# EAGLE design OSO-MISC-21-005 SAML22 Feather (EAGLE 9.6.2)
COMPANY: ADAFRUIT INDUSTRIES; DRAWN: KTOWN; REV: B
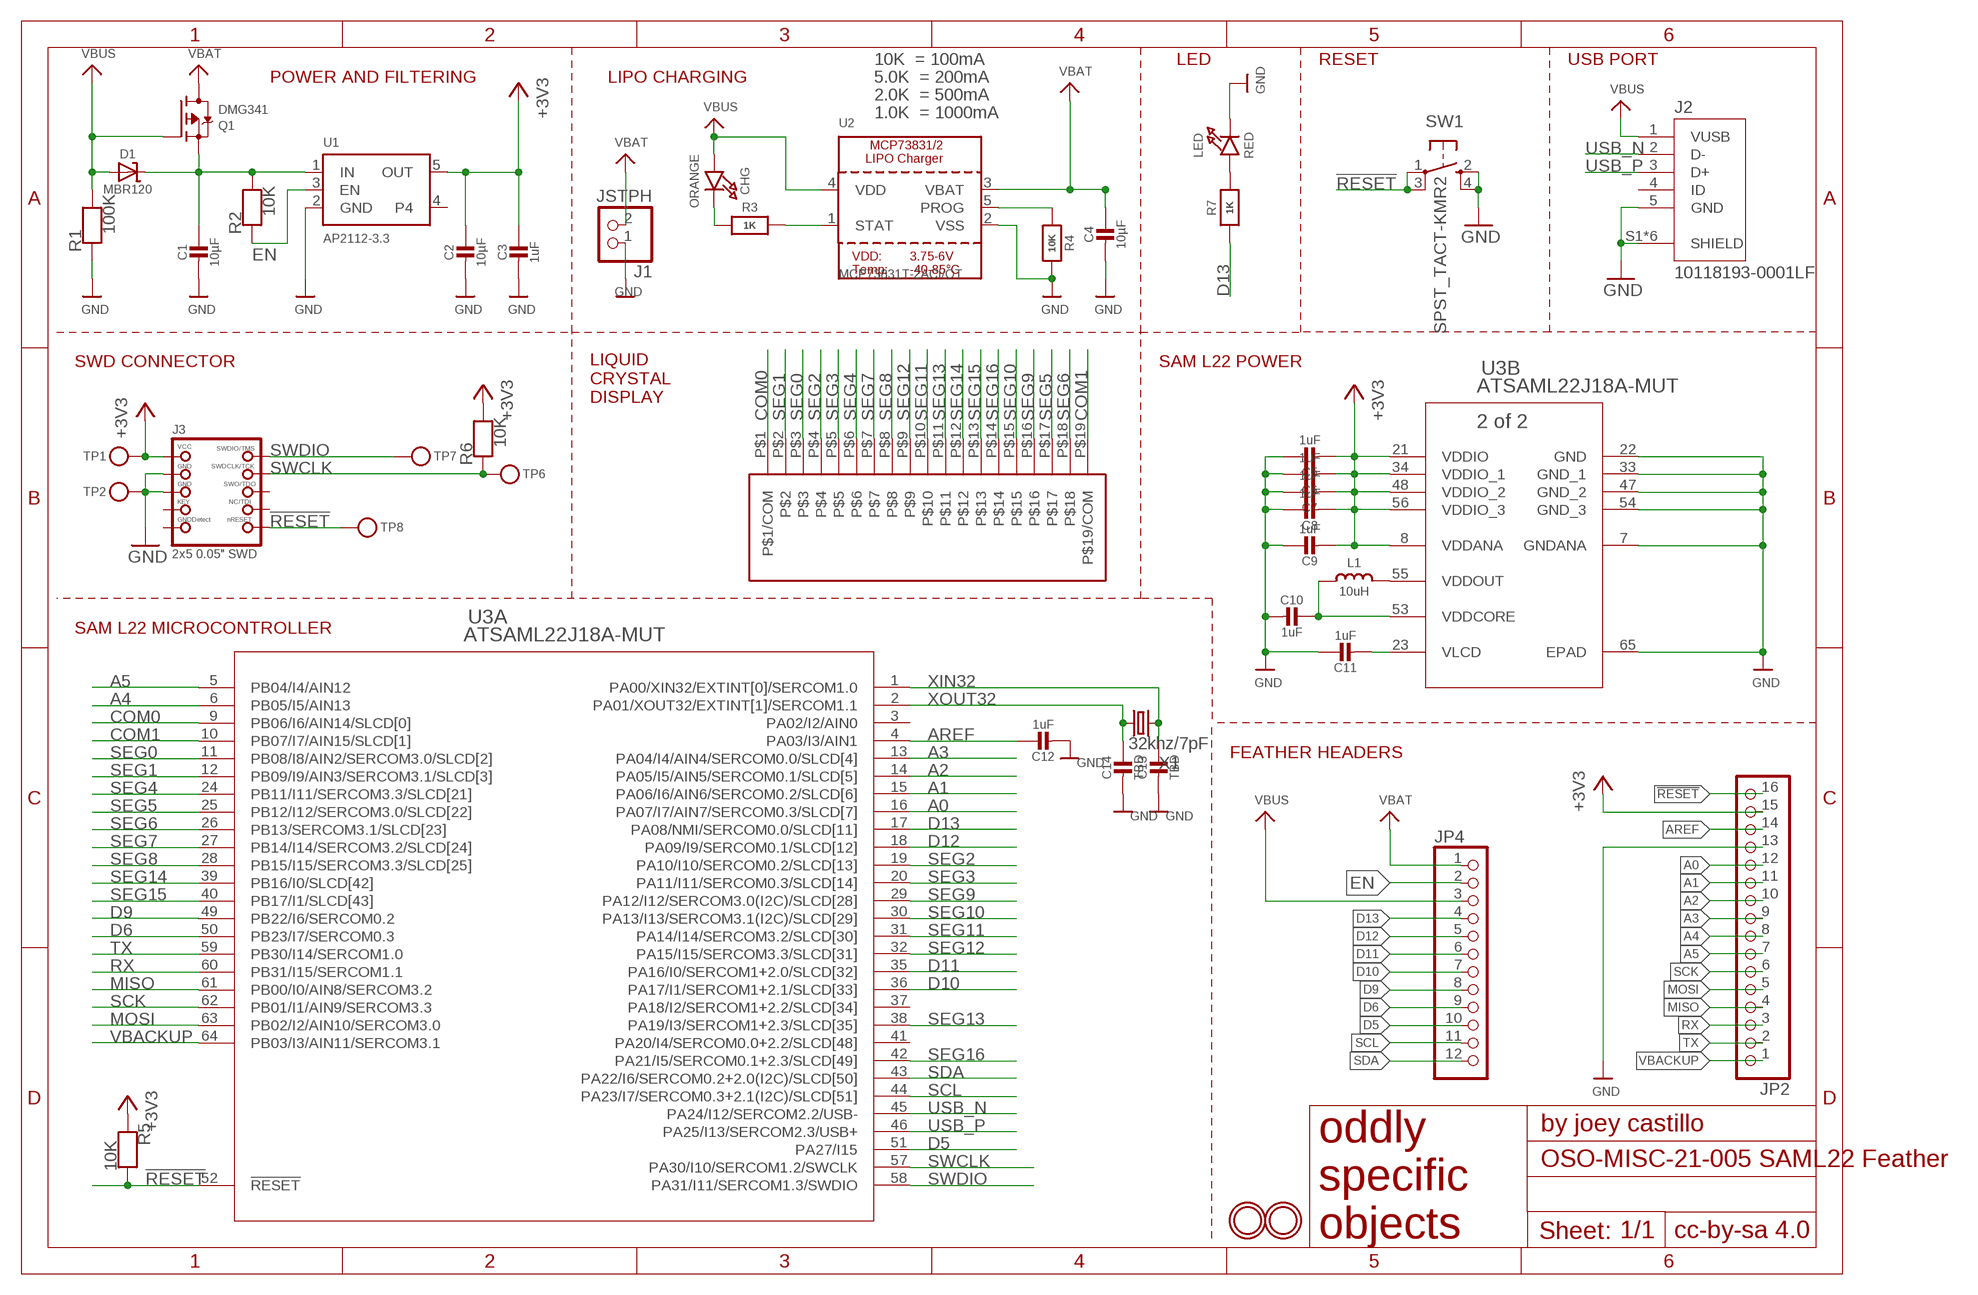
[diagram p0: schematic, sheet 1]

## Parts
C1  10µF  CAP_CERAMIC0805-NOOUTLINE  [0805-NO]
C2  10µF  CAP_CERAMIC0805-NOOUTLINE  [0805-NO]
C3  1uF  CAP_CERAMIC0603_NO  [0603-NO]
C4  10µF  CAP_CERAMIC0805-NOOUTLINE  [0805-NO]
C5  1uF  CAP_CERAMIC_0603MP  [_0603MP]
C6  1uF  CAP_CERAMIC0603_NO  [0603-NO]
C7  1uF  CAP_CERAMIC0603_NO  [0603-NO]
C8  1uF  CAP_CERAMIC0603_NO  [0603-NO]
C9  1uF  CAP_CERAMIC0603_NO  [0603-NO]
C10  1uF  CAP_CERAMIC_0603MP  [_0603MP]
C11  1uF  CAP_CERAMIC_0603MP  [_0603MP]
C12  1uF  CAP_CERAMIC0603_NO  [0603-NO]
C13  TBD  CAP_CERAMIC_0603MP  [_0603MP]
C14  TBD  CAP_CERAMIC_0603MP  [_0603MP]
CHG  ORANGE  LED0805_NOOUTLINE  [CHIPLED_0805_NOOUTLINE]
D1  MBR120  DIODE-SCHOTTKYSOD-123  [SOD-123]
J1  JSTPH  CON_JST_PH_2PIN  [JSTPH2]
J2  10118193-0001LF  [FCI_10118193-0001LF]
J3  2x5 0.05" SWD  JTAG-CORTEXBOX  [2X05_1.27MM_BOX_NOPOSTS]
JP2  HEADER-1X16_MIN  [1X16_ROUND_MIN]
JP4  HEADER-1X12_MIN  [1X12_ROUND_MIN]
L1  10uH  MICROBUILDER_INDUCTOR_0805MP  [MICROBUILDER__0805MP]
LED  RED  LED0805_NOOUTLINE  [CHIPLED_0805_NOOUTLINE]
Q1  DMG341  MOSFET-P  [SOT23-R]
R1  100K  RESISTOR_0603_NOOUT  [0603-NO]
R2  10K  RESISTOR_0603_NOOUT  [0603-NO]
R3  1K  RESISTOR_0603_NOOUT  [0603-NO]
R4  10K  RESISTOR_0603_NOOUT  [0603-NO]
R5  10K  RESISTOR_0603_NOOUT  [0603-NO]
R6  10K  RESISTOR_0603_NOOUT  [0603-NO]
R7  1K  RESISTOR_0603_NOOUT  [0603-NO]
SW1  SPST_TACT-KMR2  [KMR2]
TP1  TESTPOINTROUND2MMNO  [TESTPOINT_ROUND_2MM_NO]
TP2  TESTPOINTROUND2MMNO  [TESTPOINT_ROUND_2MM_NO]
TP6  TESTPOINTROUND2MMNO  [TESTPOINT_ROUND_2MM_NO]
TP7  TESTPOINTROUND2MMNO  [TESTPOINT_ROUND_2MM_NO]
TP8  TESTPOINTROUND2MMNO  [TESTPOINT_ROUND_2MM_NO]
U1  AP2112-3.3  VREG_SOT23-5  [SOT23-5]
U2  MCP73831T-2ACI/OT  MCP73831/2  [SOT23-5]
U3  ATSAML22J18A-MUT  [QFN64_9X9MC_MCH]
U$6  OD-372  [OD-372]
U$31  MOUNTINGHOLE2.5  [MOUNTINGHOLE_2.5_PLATED]
U$32  MOUNTINGHOLE2.5  [MOUNTINGHOLE_2.5_PLATED]
X1  32khz/7pF  CRYSTAL7015  [XTAL-7015]

## Nets
!RESET: J3.10(NRESET) JP2.16 R5.2 SW1.1(P) SW1.3(P1) TP8.P$1 U3.52(A:!RESET)
+3V3 [power]: C2.1 C3.1 C5.2 C6.2 C7.2 C8.2 C9.2 J3.1(VCC) JP2.15 R5.1 R6.2 TP1.P$1 U1.5(OUT) U3.8(B:VDDANA) U3.21(B:VDDIO) U3.34(B:VDDIO_1) U3.48(B:VDDIO_2) U3.56(B:VDDIO_3)
A0: JP2.12 U3.16(A:PA07/I7/AIN7/SERCOM0.3/SLCD[7])
A1: JP2.11 U3.15(A:PA06/I6/AIN6/SERCOM0.2/SLCD[6])
A2: JP2.10 U3.14(A:PA05/I5/AIN5/SERCOM0.1/SLCD[5])
A3: JP2.9 U3.13(A:PA04/I4/AIN4/SERCOM0.0/SLCD[4])
A4: JP2.8 U3.6(A:PB05/I5/AIN13)
A5: JP2.7 U3.5(A:PB04/I4/AIN12)
AREF: C12.1 JP2.14 U3.4(A:PA03/I3/AIN1)
CHG: CHG.C R3.1
COM0: U3.9(A:PB06/I6/AIN14/SLCD[0]) U$6.P$1(P$1/COM)
COM1: U3.10(A:PB07/I7/AIN15/SLCD[1]) U$6.P$19(P$19/COM)
D5: JP4.10 U3.51(A:PA27/I15)
D6: JP4.9 U3.50(A:PB23/I7/SERCOM0.3)
D9: JP4.8 U3.49(A:PB22/I6/SERCOM0.2)
D10: JP4.7 U3.36(A:PA17/I1/SERCOM1+2.1/SLCD[33])
D11: JP4.6 U3.35(A:PA16/I0/SERCOM1+2.0/SLCD[32])
D12: JP4.5 U3.18(A:PA09/I9/SERCOM0.1/SLCD[12])
D13: JP4.4 R7.1 U3.17(A:PA08/NMI/SERCOM0.0/SLCD[11])
EN: JP4.2 R2.1 U1.3(EN)
GND [gnd]: C1.2 C2.2 C3.2 C4.2 C5.1 C6.1 C7.1 C8.1 C9.1 C10.2 C11.1 C12.2 C13.2 C14.2 J1.1 J2.5(GND) J2.S1(SHIELD) J2.S2(SHIELD) J2.S3(SHIELD) J2.S4(SHIELD) J2.S5(SHIELD) J2.S6(SHIELD) J3.3(GND) J3.5(GND) JP2.13 LED.C R1.1 R4.2 SW1.2(S) SW1.4(S1) TP2.P$1 U1.2(GND) U2.2(VSS) U3.7(B:GNDANA) U3.22(B:GND) U3.33(B:GND_1) U3.47(B:GND_2) U3.54(B:GND_3) U3.65(B:EPAD)
MISO: JP2.4 U3.61(A:PB00/I0/AIN8/SERCOM3.2)
MOSI: JP2.5 U3.63(A:PB02/I2/AIN10/SERCOM3.0)
N$1: LED.A R7.2
PROG: R4.1 U2.5(PROG)
RX: JP2.3 U3.60(A:PB31/I15/SERCOM1.1)
SCK: JP2.6 U3.62(A:PB01/I1/AIN9/SERCOM3.3)
SCL: JP4.11 U3.44(A:PA23/I7/SERCOM0.3+2.1(I2C)/SLCD[51])
SDA: JP4.12 U3.43(A:PA22/I6/SERCOM0.2+2.0(I2C)/SLCD[50])
SEG0: U3.11(A:PB08/I8/AIN2/SERCOM3.0/SLCD[2]) U$6.P$3
SEG1: U3.12(A:PB09/I9/AIN3/SERCOM3.1/SLCD[3]) U$6.P$2
SEG2: U3.19(A:PA10/I10/SERCOM0.2/SLCD[13]) U$6.P$4
SEG3: U3.20(A:PA11/I11/SERCOM0.3/SLCD[14]) U$6.P$5
SEG4: U3.24(A:PB11/I11/SERCOM3.3/SLCD[21]) U$6.P$6
SEG5: U3.25(A:PB12/I12/SERCOM3.0/SLCD[22]) U$6.P$17
SEG6: U3.26(A:PB13/SERCOM3.1/SLCD[23]) U$6.P$18
SEG7: U3.27(A:PB14/I14/SERCOM3.2/SLCD[24]) U$6.P$7
SEG8: U3.28(A:PB15/I15/SERCOM3.3/SLCD[25]) U$6.P$8
SEG9: U3.29(A:PA12/I12/SERCOM3.0(I2C)/SLCD[28]) U$6.P$16
SEG10: U3.30(A:PA13/I13/SERCOM3.1(I2C)/SLCD[29]) U$6.P$15
SEG11: U3.31(A:PA14/I14/SERCOM3.2/SLCD[30]) U$6.P$10
SEG12: U3.32(A:PA15/I15/SERCOM3.3/SLCD[31]) U$6.P$9
SEG13: U3.38(A:PA19/I3/SERCOM1+2.3/SLCD[35]) U$6.P$11
SEG14: U3.39(A:PB16/I0/SLCD[42]) U$6.P$12
SEG15: U3.40(A:PB17/I1/SLCD[43]) U$6.P$13
SEG16: U3.42(A:PA21/I5/SERCOM0.1+2.3/SLCD[49]) U$6.P$14
STAT: R3.2 U2.1(STAT)
SWCLK: J3.4(SWDCLK) R6.1 TP6.P$1 U3.57(A:PA30/I10/SERCOM1.2/SWCLK)
SWDIO: J3.2(SWDIO) TP7.P$1 U3.58(A:PA31/I11/SERCOM1.3/SWDIO)
TX: JP2.2 U3.59(A:PB30/I14/SERCOM1.0)
USB_N: J2.2(D-) U3.45(A:PA24/I12/SERCOM2.2/USB-)
USB_P: J2.3(D+) U3.46(A:PA25/I13/SERCOM2.3/USB+)
VBACKUP: JP2.1 U3.64(A:PB03/I3/AIN11/SERCOM3.1)
VBAT [power]: C4.1 J1.2 JP4.1 Q1.3(D) U2.3(VBAT)
VBUS [power]: CHG.A D1.A J2.1(VUSB) JP4.3 Q1.1(G) R1.2 U2.4(VDD)
VDDCORE: C10.1 L1.1 U3.53(B:VDDCORE)
VDDOUT: L1.2 U3.55(B:VDDOUT)
VHI [power]: C1.1 D1.C Q1.2(S) R2.2 U1.1(IN)
VLCD: C11.2 U3.23(B:VLCD)
XIN32: C13.1 U3.1(A:PA00/XIN32/EXTINT[0]/SERCOM1.0) X1.4
XOUT32: C14.1 U3.2(A:PA01/XOUT32/EXTINT[1]/SERCOM1.1) X1.1
Unconnected: J2.4(ID) J3.6(SWO) J3.7(KEY) J3.8(TDI) J3.9(GNDDETECT) U1.4 U3.3(A:PA02/I2/AIN0) U3.37(A:PA18/I2/SERCOM1+2.2/SLCD[34]) U3.41(A:PA20/I4/SERCOM0.0+2.2/SLCD[48])

## Notes on the sheet
- 10K  = 100mA | LED | RESET | USB PORT
- POWER AND FILTERING | LIPO CHARGING | 5.0K  = 200mA
- 2.0K  = 500mA
- 1.0K  = 1000mA
- SWD CONNECTOR | SAM L22 POWER
- LIQUID
  CRYSTAL
  DISPLAY
- SAM L22 MICROCONTROLLER
- FEATHER HEADERS

## Library data of the parts
C1-C14 = microbuilder:CAP_CERAMIC: Ceramic Capacitors For new designs, use the packages preceded by an '_' character since they are more reliable: The following footprints should be used on most boards: _0402 - Standard footprint for regular board layouts _0603 - Standard footprint for regular board layouts _0805 - Standard footprint for regular board layouts _1206 - Standard footprint for regular board layouts For extremely tight-pitch boards where space is at a premium, the following 'micro-pitch' footprints can be used (smaller pads, no silkscreen outline, etc.): _0402MP - Micro-pitch footprint for very dense/compact boards _0603MP - Micro-pitch footprint for very dense/compact boards _0805MP - Micro-pitch footprint for very dense/compact boards _1206MP - Micro-pitch footprint for very dense/compact boards
CHG LED = microbuilder:LED: LED 0603 - 0603 Surface Mount Package 2mA: Green LED - Low Power (3.9mcd, 2ma, 1.7Vf) - Digikey: 475-2709-2-ND Orange LED - Low Power (9.8mcd, 2ma, 1.8Vf) - Digikey: 475-1194-2-ND Red LED - Low Power (5mcd, 2ma, 1.8Vf) - Digikey: 475-1195-2-ND Yellow LED - Low Power (7mcd, 2ma, 1.8Vf) - Digikey: 475-1196-2-ND 5mA: Blue LED - Low Power (17mcd, 5ma, 2.9Vf) - Digikey: LNJ937W8CRACT-ND 0805 - 0805 Surface Mount Package 2mA: Red LED (8.8mcd, 2mA, 1.8Vf, Clear) - Low Power [Digikey: 475-2510-1-ND] Green LED (5mcd, 2mA, 1.8Vf, Clear) - Low Power [Digikey: 475-2730-1-ND] Yellow LED (11.3mcd, 2mA, 1.8Vf, Clear) - Low Power [Digikey: 475-2555-1-ND] 20mA: Red LED (104mcd, 20mA, Diffused) - LS R976 [Digikey: 475-1278-6-ND] Red LED (12mcd, 20mA, 2.0Vf, Clear) - APT2012EC [Digikey: 754-1128-1-ND] Green LED (15mcd, 20mA, 2.2Vf, Clear) - APT2012GC [Digikey: 754-1131-1-ND] Orange LED (160mcd, 20mA, 2.1Vf, Clear) - APT2012SECK [Digikey: 754-1130-1-ND] 1206 - 1206 Surface Mount Package Green LED (26mcd, 20mA, Diffused) - LG N971 [Digikey: 475-1407-6-ND] Red LED (15mcd, 20mA, Diffused) - LH N974 [Digikey: 475-1416-6-ND] Cree - Cree High-Power Surface Mount LEDs XPEBWT-L1-0000-00D50 - White 111lm 350mA 2.9Vf 6200K 110° XTEAWT-00-0000-00000LEE3 - White 114lm 350mA 2.85Vf 5000K 115° Everlight - Everlight 45-21 Series Surface Mount LEDs 45-21/QK2C-B2832AC2CB2/2T - Warm White 2000mcd 20mA 3.25Vf 3050K 120° 45-21/LK2C-B38452C4CB2/2T - Nuetral White 2000mcd 20mA 3.25Vf 4150K 120° 45-21/LK2C-B50634C6CB2/2T - Cold White 2200mcd 20mA 3.25Vf 5650K 120° PLCC2 Reverse Mount LS T77K-J1L2-1-0-2-R18-Z - Red 11.25mcd 2mA 1.8Vf 630nm 120° LO T77K-L1M2-24-Z - Orange 19.6mcd 2mA 1.8Vf 606nm 120° LY T77K-K2M1-26-Z - Yellow 15.7mcd 2mA 1.8Vf 587nm 120°
D1 = microbuilder:DIODE-SCHOTTKY
J1 = microbuilder:CON_JST_PH_2PIN: JST 2-Pin Right-Angle Connector PH-Series - 4UConnector: 17311 SH-Series - 4UConnector: 07278
J2 = 10118193-0001LF:10118193-0001LF: Micro USB B Type Receptacle; DESCRIPTION: Single Port 5 Contact Shielded SMT MICRO USB B-Type Receptacle; DIGI-KEY_PART_NUMBER: 609-4616-1-ND; DIGI-KEY_PURCHASE_URL: https://www.digikey.com/product-detail/en/amphenol-icc-fci/10118193-0001LF/609-4616-1-ND/2785380?utm_source=snapeda&utm_medium=aggregator&utm_campaign=symbol; MF: Amphenol ICC; MP: 10118193-0001LF; PACKAGE: None
J3 = microbuilder:JTAG-CORTEX: Serial Wire (SW-DP) Connector Standard 0.05" 10-pin connector is for use with the Cortex M and Cortex A SWD (serial wire debugger) interface (SW-DP) Connectors 2x05_1.27MM_SMT - Inexpensive surface-mount header with bare pins, compatible with standard 10-pin SWD cables (4UCON: 16846) 2x05_1.27MM_BOX_NOPOSTS - Polarised surface-mount box (4UCON with caps: 19735, without caps: 15117 2x05_1.27MM_BOX_POSTS - Polarised surface-mount box with mounting holes (4UCON: 20317) Pinout: http://infocenter.arm.com/help/topic/com.arm.doc.faqs/attached/13634/cortex_debug_connectors.pdf http://www.keil.com/peripherals/coresight/connectors.asp
JP2 = microbuilder:HEADER-1X16: PIN HEADER
JP4 = microbuilder:HEADER-1X12
L1 = Adafruit 3.5in 480x320 FeatherWing:MICROBUILDER_INDUCTOR: Inductors 0603: 10nH Ceramic Inductor - microwire antenna/RF (Digikey: 712-1434-2-ND) 0805: 560nH Ceramic Inductor - RF (Digikey: 553-1047-1-ND) 270nH Ceramic Inductor - Q = 40@250MHz, +-5%, 1 Ohm DC Resistance (Digikey: 535-10506-2-ND) 1007 (2518 Metric) SMT: 10µH 10% 250mOhm 820mA 1007 Inductor (Digikey: 587-2189-1-ND) 22µH 10% 500mOhm 580mA 1007 Inductor (Digikey: 587-2190-1-ND) 47µH 10% 950mOhm 420mA 1007 Inductor (Digikey: 587-2191-1-ND) 47µH 5% 100mOhm 1A 1008 Inductor (Digikey: 732-1816-1-ND) 5.0x5.0mm (Taiyo Yuden NR5040 Series) 6.8µH 20% 2.3A 64mOhm Inductor (Digikey: 587-2374-2-ND) 5.0x5.0mm (TDK VLC5045 Series) 4.7µH 20% 3.3A 34mOhm Inductor (Digikey: 445-6526-1-ND) 6.8µH 20% 2.7A 46mOhm Inductor (Digikey: 445-6527-1-ND) 6.0x6.0mm (TDK VLC6045 Series) 4.7µH 20% 3.8A 27mOhm Inductor (Digikey: 445-6538-2-ND) 6.8µH 20% 3A 41mOhm Inductor (Digikey: 445-6540-1-ND) 6.2µH 30% 2.2A 45mOhm Inductor (Digikey: SRR5028-6R2YCT-ND) - Not TDK VLC6045 but footprint should match 6.0x6.0mm (TDK SLF6045 Series) 6.8uH 30% 2A 33mOhm Inductor (Digikey: 445-4572-1-ND, Mouser: 810-SLF645T6R8N2R0PF) 6.0x6.0mm (Sumida CDRH5D28 Series) 6.2uH 30% 1.8A 45mOhm Inductor (Digikey: 308-1542-1-ND) Taiyo Yuden NR3015T2R2M - 2.2uH 20% 1.5A (Digikey: 587-1648-2-ND, Mouser: 963-NR3015T2R2M) - Used with TI TPS62172 CoilCraft RFID Transponder Coil - MA5532-AE (For use with AS3935 Lightning Sensor) Taiyo Yuden NRH2412T2R2MNGH - 2.2uH 20% 1AA (Digikey: 587-3443-1-ND) - Used with TI LM3671 Vishay IHLP 1.0uH Molded Inductor - 24mOhm DCR, 5A, +/-20%, -55°C-125°C (Digikey: 541-1319-1-ND)
Q1 = microbuilder:MOSFET-P: P-Channel Mosfet LEGEND VDS: Voltage Drain-Source ID: Drain Current RDS(ON): Drain-Source On-State Resistance VGS(TH): Gate-Source Threshold Voltage CISS: Drain-Source Input Capacitance SOT-23 Name VDS ID RDS(ON) VGS(TH) CISS Order Number IRLML5103 30V 760mA 600 mOhm -- 75pF @ 25V Digikey: IRLML5103PBFCT-ND IRLML6401 12V 4.3A 50 mOhm 950mV @ 250µA 830pF @ 10V Digikey: IRLML6401PBFTR-ND NTR0202PL 20V 400mA 800 mOhm 2.3V @ 250uA 70pF @ 5V Digikey: NTR0202PLT1GOSTR-ND NTR4101PT1G 20V 1.8A 85 mOhm 1.2V @ 250uA 675pF @ 10V Digikey: NTR4101PT1GOSCT-ND DMP2004K 20V 600mA 900 mOhm 1V @ 250uA 175pF @ 16V Digikey: DMP2004KDICT-ND PMV65XP 20V 3.9A 76 mOhm 950mV @ 1mA 725pF @ 20V Digikey: 568-2358-2-ND TO-252 Name VDS ID RDS(ON) VGS(TH) CISS Order Number AOD417 30V 25A 34 mOhm 3V @ 250µA 920pF @ 15V Digikey: 785-1106-2-ND PowerPak Name VDS ID RDS(ON) VGS(TH) CISS Order Number AON7401 30V 12A 14 mOhm 3V @ 250µA 2600pF @ 15V Digikey: 785-1302-1-ND
R1-R7 = microbuilder:RESISTOR: Resistors For new designs, use the packages preceded by an '_' character since they are more reliable: The following footprints should be used on most boards: _0402 - Standard footprint for regular board layouts _0603 - Standard footprint for regular board layouts _0805 - Standard footprint for regular board layouts _1206 - Standard footprint for regular board layouts For extremely tight-pitch boards where space is at a premium, the following 'micro-pitch' footprints can be used (smaller pads, no silkscreen outline, etc.): _0402MP - Micro-pitch footprint for very dense/compact boards _0603MP - Micro-pitch footprint for very dense/compact boards _0805MP - Micro-pitch footprint for very dense/compact boards _1206MP - Micro-pitch footprint for very dense/compact boards
SW1 = adafruit:SPST_TACT: SMT 6mm switch, EVQQ2 series http://www.ladyada.net/library/eagle
TP1 TP2 TP6-TP8 = microbuilder:TESTPOINT: Test Point Various test points for characterisation and PCB testing TESTPOINT_SMT - Compact Surface Mount Test Point [Digikey: 5016KTR-ND]
U1 = microbuilder:VREG_SOT23-5: SOT23-5 Fixed Voltage Regulators Part Current Out V Out V In V Dropout θJA (°C/W) TJ (°C) Digikey Part No. ADP121 150mA 3.3V 3.4-5.5V 0.09V @ 150mA -- -- ADP121-AUJZ33R7CT-ND ADP121 150mA 3.0V 3.1-5.5V 0.09V @ 150mA -- -- ADP121-AUJZ30R7CT-ND ADP122 300mA 3.3V 3.4-5.5V 0.085V @ 300mA -- -- ADP122AUJZ-3.3-R7CT-ND ADP1712 300mA 3.3V 3.5-5.5V 0.17V @ 300mA -- -- ADP1712AUJZ-3.3-R7TR-ND AP7311 (Low Cost) 150mA 3.3V 3.5-6V 0.15V @ 150mA -- -- AP7311-33WG-7DICT-ND LD39015M18R 150mA 1.8V 1.9V-5.5V 0.08V @ 100mA -- -- 497-6977-1-ND LP2985A-33DBVR 150mA 3.3V 3.3-16V 0.28V @ 150mA 206 150 296-18479-1-ND MCP1824T-3302E/OT 300mA 3.3V 3.5V-6V 0.2V @ 300mA -- -- MCP1824T-3302E/OTCT-ND MIC5205-2.5YM5 TR 150mA 2.5V 2.7-16V 0.165V @ 150mA -- -- 576-1257-2-ND MIC5205-3.0YM5 TR 150mA 3.0V 3.2V-16V 0.165V @ 150mA -- -- 576-1258-2-ND MIC5205-3.3YM5 TR 150mA 3.3V 3.5V-16V 0.165V @ 150mA -- -- 576-1259-2-ND TPS780330220 150mA 3.3V+2.2V 3.6-5.5V 250mV Max -- -- 296-23332-1-ND TDA3663/N1,135 100mA 3.3V 3.5-45V 0.18V @ 50mA -- -- 568-5343-1-ND Max operating temp can be calculated using θJA, TJ (max junction temperature), and power in watts. Set the "Maximum Ambient Temperature" until it reaches TJ ("Max Junction Temperature"), which is the absolute limit for safe use of the regulator: Heat Sink Temperature Calculator <http://www.daycounter.com/Calculators/Heat-Sink-Temperature-Calculator.phtml> For example, With 12V source into a 3.3V LP2985 and a 30mA load, we are dissipating (12V-3.3V) * 0.03A = 0.261W. With a θJA of 206 °C/W, a TJ of 150°C, and 261mW we can safely use the chip without a heat sink up to 75°C (=147.1°C Junction Temperature).
U2 = microbuilder:MCP73831/2: MCP73831/2 LIPO Charger VDD: 3.75 - 6V Temp -40 - 85°C Programmable Charge Rate: 15-500mA NOTE: STAT is a tri-state logic output on the MCP73831 and an open-drain output on the MCP73832. SOT23-5 with 4.2V output and tri-state logic on STAT = MCP73831T-2ACI/OT
U3 = ATSAML22:ATSAML22J18A-MUT; BUILT_BY: EMA_Molly; COPYRIGHT: Copyright (C) 2018 Accelerated Designs. All rights reserved; MANUFACTURER_PART_NUMBER: ATSAML22J18A-MUT; SOURCELIBRARY: Microchip_2019-08-23_25; VENDOR: Microchip
U$6 = slcd:OD-372
U$31 U$32 = microbuilder:MOUNTINGHOLE: Mounting Hole For #2 screws (0.086"/2.18mm width, 0.094"/2.4mm hole) use 2.5mm; BOM: EXCLUDE
X1 = My Stuff:CRYSTAL: CRYSTAL

## Net classes
0 default: width 0.152 mm, drill 0.305 mm
1 power: width 0.254 mm, drill 0.305 mm
2 gnd: width 0.254 mm, drill 0.305 mm

## Board
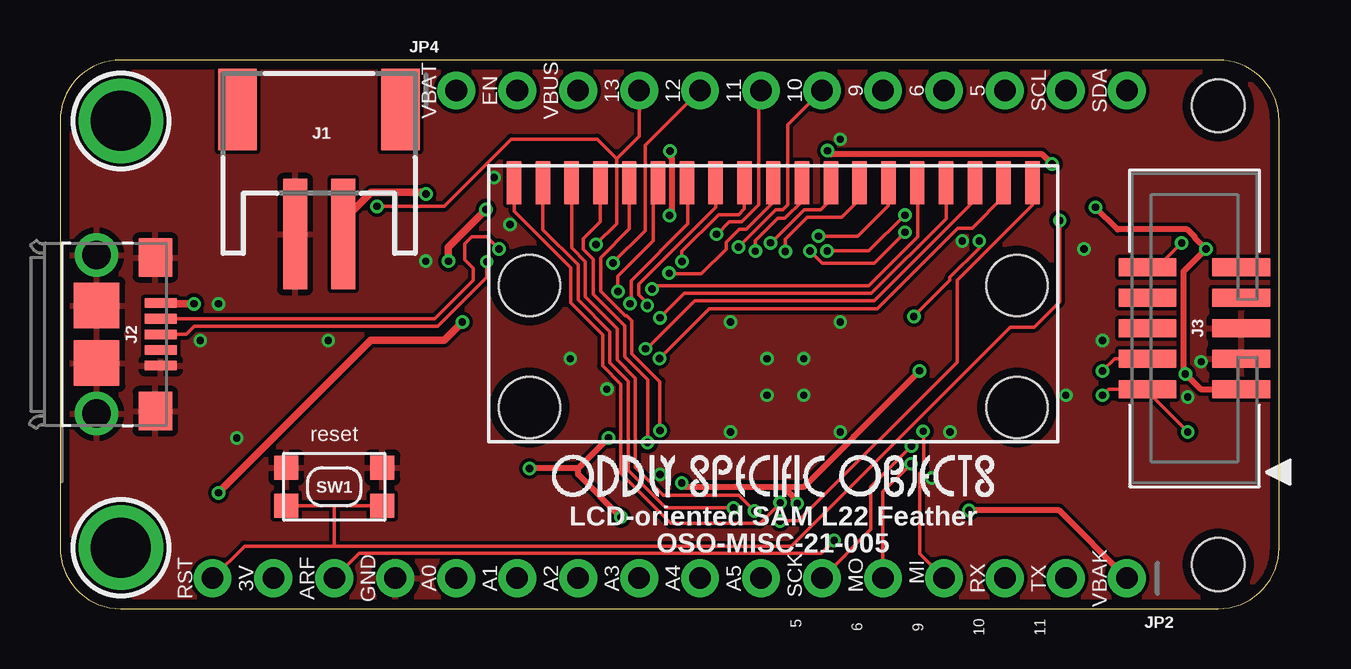
[diagram p1: board, top side]
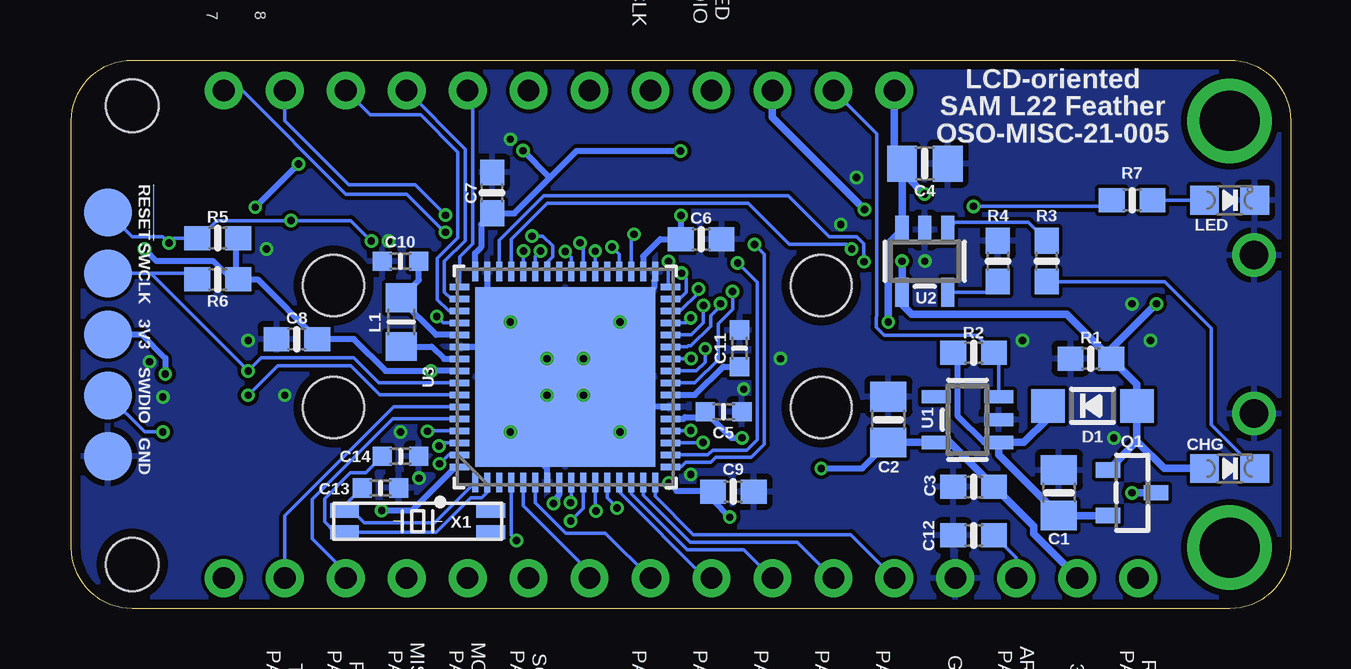
[diagram p2: board, bottom side, seen from below]

Size 50.8 x 22.86 mm. Coordinates in mm from the lower left corner, seen from the top.
Outline: 2.54,0 48.26,0 arc90 50.8,2.54 50.8,20.32 arc90 48.26,22.86 2.54,22.86 arc90 0,20.32 0,2.54 arc90 2.54,0
Copper layers (1*16): Top 0.035559375mm / dielectric 1.6mm / Bottom 0.035559375mm
Design rules "oshpark-2layer *": minimum track width 6mil, minimum drill 10mil, track to track 6mil, track to pad 6mil, pad to pad 6mil, via to via 6mil, smd to smd 6mil, copper to edge 15mil, drill to drill 6mil, minimum pad ring 5mil, minimum via ring 5mil, stop-mask expansion 2.5mil, vias tented up to drill 12mil, thermal gap 10mil
Holes 2.2 mm at 48.26,1.84 48.26,20.95
Holes 2.54 mm at 19.56,8.38 39.88,8.38 19.56,13.46 39.88,13.46

### Footprints (pad centres in the part's own frame; a part is rotated, then mirrored left to right if it is on the bottom)
0805-NO = smd 1.24 x 1.5: 1 -0.95,0; 2 0.95,0
0603-NO = smd 1.075 x 1: 1 -0.85,0; 2 0.85,0
_0603MP = smd 0.8 x 0.8: 1 -0.762,0; 2 0.762,0
CHIPLED_0805_NOOUTLINE = smd 1.2 x 1.2: A 0,-1.05; C 0,1.05
SOD-123 = smd 1.4 x 1.4: A 1.85,0; C -1.85,0
JSTPH2 = smd 1 x 4.6: 1 -1,-3.7; 2 1,-3.7 | smd 1.6 x 3.4: NC1 -3.4,1.5; NC2 3.4,1.5
FCI_10118193-0001LF = smd 0.4 x 1.35: 1 -1.3,2.675; 2 -0.65,2.675; 3 0,2.675; 4 0.65,2.675; 5 1.3,2.675 | smd 1.6 x 1.4: S1 -3.2,2.45; S2 3.2,2.45 | smd 1.9 x 1.9: S3 1.2,0; S4 -1.2,0 | drill 1.2: S5 3.302,0; S6 -3.302,0
2X05_1.27MM_BOX_NOPOSTS = smd 0.76 x 2.4: 1 -2.54,-1.95; 2 -2.54,1.95; 3 -1.27,-1.95; 4 -1.27,1.95; 5 0,-1.95; 6 0,1.95; 7 1.27,-1.95; 8 1.27,1.95; 9 2.54,-1.95; 10 2.54,1.95
1X16_ROUND_MIN = drill 0.9 pad 1.575: 1 -19.05,0; 2 -16.51,0; 3 -13.97,0; 4 -11.43,0; 5 -8.89,0; 6 -6.35,0; 7 -3.81,0; 8 -1.27,0; 9 1.27,0; 10 3.81,0; 11 6.35,0; 12 8.89,0; 13 11.43,0; 14 13.97,0; 15 16.51,0; 16 19.05,0
1X12_ROUND_MIN = drill 0.9 pad 1.575: 1 -13.97,0; 2 -11.43,0; 3 -8.89,0; 4 -6.35,0; 5 -3.81,0; 6 -1.27,0; 7 1.27,0; 8 3.81,0; 9 6.35,0; 10 8.89,0; 11 11.43,0; 12 13.97,0
MICROBUILDER__0805MP = smd 1.2 x 1.3: 1 -1.016,0; 2 1.016,0
SOT23-R = smd 0.635 x 1.016: 1 -0.95,-1; 2 0.95,-1; 3 0,1
KMR2 = smd 1 x 1: 1 2,0.8; 2 2,-0.8; 3 -2,0.8; 4 -2,-0.8
TESTPOINT_ROUND_2MM_NO = smd 2 x 2: P$1 0,0
SOT23-5 = smd 0.55 x 1.2: 1 -0.95,-1.3; 2 0,-1.3; 3 0.95,-1.3; 4 0.95,1.3; 5 -0.95,1.3
QFN64_9X9MC_MCH = smd 0.813 x 0.254: 1 -4.394,3.75; 2 -4.394,3.25; 3 -4.394,2.75; 4 -4.394,2.25; 5 -4.394,1.75; 6 -4.394,1.25; 7 -4.394,0.75; 8 -4.394,0.25; 9 -4.394,-0.25; 10 -4.394,-0.75; 11 -4.394,-1.25; 12 -4.394,-1.75; 13 -4.394,-2.25; 14 -4.394,-2.75; 15 -4.394,-3.25; 16 -4.394,-3.75; 33 4.394,-3.75; 34 4.394,-3.25; 35 4.394,-2.75; 36 4.394,-2.25; 37 4.394,-1.75; 38 4.394,-1.25; 39 4.394,-0.75; 40 4.394,-0.25; 41 4.394,0.25; 42 4.394,0.75; 43 4.394,1.25; 44 4.394,1.75; 45 4.394,2.25; 46 4.394,2.75; 47 4.394,3.25; 48 4.394,3.75 | smd 0.254 x 0.813: 17 -3.75,-4.394; 18 -3.25,-4.394; 19 -2.75,-4.394; 20 -2.25,-4.394; 21 -1.75,-4.394; 22 -1.25,-4.394; 23 -0.75,-4.394; 24 -0.25,-4.394; 25 0.25,-4.394; 26 0.75,-4.394; 27 1.25,-4.394; 28 1.75,-4.394; 29 2.25,-4.394; 30 2.75,-4.394; 31 3.25,-4.394; 32 3.75,-4.394; 49 3.75,4.394; 50 3.25,4.394; 51 2.75,4.394; 52 2.25,4.394; 53 1.75,4.394; 54 1.25,4.394; 55 0.75,4.394; 56 0.25,4.394; 57 -0.25,4.394; 58 -0.75,4.394; 59 -1.25,4.394; 60 -1.75,4.394; 61 -2.25,4.394; 62 -2.75,4.394; 63 -3.25,4.394; 64 -3.75,4.394 | smd 7.493 x 7.493: 65 0,0
OD-372 = smd 0.6 x 1.8: P$1 -10.8,5.05; P$2 -9.6,5.05; P$3 -8.4,5.05; P$4 -7.2,5.05; P$5 -6,5.05; P$6 -4.8,5.05; P$7 -3.6,5.05; P$8 -2.4,5.05; P$9 -1.2,5.05; P$10 0,5.05; P$11 1.2,5.05; P$12 2.4,5.05; P$13 3.6,5.05; P$14 4.8,5.05; P$15 6,5.05; P$16 7.2,5.05; P$17 8.4,5.05; P$18 9.6,5.05; P$19 10.8,5.05
MOUNTINGHOLE_2.5_PLATED = drill 2.5 pad 3.2: P$1 0,0
XTAL-7015 = smd 1.2 x 0.6: 1 -3.05,-0.45; 2 3.05,-0.45; 3 3.05,0.45; 4 -3.05,0.45

### Placement (x,y rotation side)
C1  9.65,4.83 90 bottom
C2  16.76,7.87 90 bottom
C3  13.21,5.08 180 bottom
C4  15.24,18.54 0 bottom
C5  23.62,8.2 180 bottom
C6  24.56,15.39 180 bottom
C7  33.27,17.32 270 bottom
C8  41.4,11.23 0 bottom
C9  23.22,4.88 180 bottom
C10  37.08,14.48 180 bottom
C11  22.96,10.85 270 bottom
C12  13.21,3.05 180 bottom
C13  37.92,5.03 0 bottom
C14  37.08,6.35 0 bottom
CHG  2.54,5.84 270 bottom
D1  8.26,8.45 0 bottom
J1  10.79,19.3 0 top
J2  1.52,11.43 270 top
J3  47.27,11.68 90 top
JP2  25.4,1.27 180 top
JP4  30.48,21.59 0 top
L1  37.06,11.94 270 bottom
LED  2.54,17.02 270 bottom
Q1  6.6,4.83 270 bottom
R1  8.32,10.41 0 bottom
R2  13.21,10.67 180 bottom
R3  10.16,14.48 90 bottom
R4  12.19,14.48 90 bottom
R5  44.7,15.44 180 bottom
R6  44.7,13.72 0 bottom
R7  6.6,17.02 0 bottom
SW1  11.43,5.08 180 top
TP1  49.28,11.43 0 bottom
TP2  49.28,6.35 0 bottom
TP6  49.28,13.97 0 bottom
TP7  49.28,8.89 0 bottom
TP8  49.28,16.51 0 bottom
U1  13.46,7.87 90 bottom
U2  15.24,14.48 180 bottom
U3  30.23,9.65 90 bottom
U$6  29.72,12.7 0 top
U$12  [OSO_WORDMARK_ONELINE_350MIL_1000DPI]  9.27,27.81 0 bottom  (outside the outline)
U$13  [OSO_WORDMARK_ONELINE_725MIL_1000DPI]  20.45,4.57 0 top
U$31  2.54,20.32 270 top
U$32  2.54,2.54 270 top
X1  36.37,3.63 0 bottom

### Tracks (layer width: path | path; a pad name or v marks a point on that pad's centre or on a via)
!RESET  (via drill 0.3)
  Top 0.152: J3.10 45.72,14.22 v46.74,15.24 | JP2.16 7.69,2.61 11.43,2.61 | 11.43,2.61 30.47,2.61 39.59,11.73 40.59,11.73 41.66,12.8 v41.66,16.17 | v35.58,12.18 37.08,13.68 37.08,13.8 38.3,15.03 v38.3,15.31 | SW1.3 11.43,4.28 | 11.43,4.28 SW1.1 | 11.43,4.28 11.43,2.61
  Bottom 0.152: TP8.P$1 48.26,15.49 46.99,15.49 v46.74,15.24 46.53,15.44 R5.2 45.47,15.44 44.74,16.17 v41.66,16.17 39.16,16.17 v38.3,15.31 | U3.52 35.3,11.9 v35.58,12.18
+3V3  (via drill 0.3)
  Top 0.254: v25.91,5.23 26.06,5.08 30.13,5.08 | v30.72,4.38 30.57,4.53 30.57,4.65 30.13,5.08 | J3.1 47.52,9.14 v46.89,9.78 46.81,9.86 46.81,14.05 v47.75,14.99 47.3,15.44 47.3,15.47 46.97,15.8 44.06,15.8 v43.14,16.72 | v22.86,7.12 21.58,5.84 | 21.58,5.84 v19.56,5.84 | v23.37,3.81 21.58,5.59 21.58,5.84 | v35.81,9.91 33.07,7.17 33.07,7.13 31.02,5.08 30.13,5.08 | v25.41,19.06 25.41,18.85 25.5,18.77 25.5,16.48 v25.4,16.38 | v31.98,19.08 32.13,18.93 40.93,18.93 v41.34,18.52
  Bottom 0.254: U3.21 25.31,7.9 25.23,7.98 24.61,7.98 C5.2 23.3,7.12 v22.86,7.12 | U3.8 30.48,4.74 30.57,4.65 30.57,4.53 v30.72,4.38 | v25.91,5.23 25.58,4.9 24.09,4.9 C9.2 24.07,4.51 v23.37,3.81 | U3.48 33.98,14.81 33.73,15.06 33.73,16.02 C7.2 32.35,16.47 30.86,17.96 | U3.34 26.98,14.68 26.26,15.39 C6.2 25.4,15.4 v25.4,16.38 | TP1.P$1 47.88,11.43 46.89,10.44 v46.89,9.78 | 43.94,13.72 44.12,13.72 44.9,14.49 47.26,14.49 v47.75,14.99 | 43.94,13.72 R6.2 43.04,13.72 C8.2 39.03,11.23 37.7,9.9 35.82,9.9 v35.81,9.91 U3.56 | R5.1 43.94,15.36 43.94,13.72 | v19.56,5.84 17.85,5.84 C2.1 | 30.86,17.96 29.75,19.07 25.43,19.07 v25.41,19.06 | v31.98,19.08 30.86,17.96 | v41.34,18.52 v43.14,16.72
  Bottom 0.305: JP2.15 8.89,1.31 10.71,3.13 10.71,3.43 C3.1 14.2,6.92 U1.5 C2.1
A0
  Bottom 0.152: JP2.12 18.32,3.08 24.89,3.08 26.48,4.67 U3.16
A1
  Bottom 0.152: JP2.11 20.55,2.77 25.02,2.77 26.98,4.73 U3.15
A2
  Bottom 0.152: U3.14 27.48,4.79 25.15,2.46 22.78,2.46 JP2.10
A3
  Bottom 0.152: U3.13 27.98,4.86 24.38,1.27 JP2.9
A4
  Bottom 0.152: U3.6 31.48,4.42 30.21,3.15 28.55,3.15 JP2.8
A5
  Bottom 0.152: U3.5 31.98,4.29 29.21,1.52 JP2.7
AREF  (via drill 0.3)
  Top 0.152: JP2.14 12.46,2.3 31.73,2.3 v32.26,2.84
  Bottom 0.152: U3.4 32.48,3.06 v32.26,2.84 | C12.1 11.43,2.12 JP2.14
CHG
  Bottom 0.152: R3.1 5.25,13.63 3.3,11.68 3.3,7.65 CHG.C
COM0  (via drill 0.3)
  Top 0.152: U$6.P$1 18.92,16.57 21.29,14.2 21.29,12.74 22.61,11.41 22.61,10.12 23.37,9.36 23.37,5.63 25.45,3.56 29.17,3.56 30.01,4.39 v30.01,4.41
  Bottom 0.152: U3.9 29.98,4.45 v30.01,4.41
COM1  (via drill 0.3)
  Top 0.152: v30,3.65 30.76,3.65 37.38,10.28 37.38,13.67 40.52,16.81 U$6.P$19
  Bottom 0.152: U3.10 29.48,4.18 v30,3.65
D5
  Bottom 0.152: U3.51 35.08,12.4 35.56,12.88 35.56,14.59 34.7,15.46 34.7,19.02 36.24,20.57 38.35,20.57 JP4.10
D6
  Bottom 0.152: JP4.9 34.39,19.15 34.39,15.33 35.26,14.47 35.26,13.18 34.98,12.9 U3.50
D9
  Bottom 0.152: JP4.8 34.09,21.39 34.09,15.21 34.62,14.67 U3.49
D10  (via drill 0.3)
  Top 0.152: JP4.7 30.32,20.16 30.32,16.83 30.11,16.62 29.83,16.62 v28.27,15.06
  Bottom 0.152: U3.36 27.98,14.77 v28.27,15.06
D11  (via drill 0.3)
  Top 0.152: JP4.6 29.11,21.49 29.11,16.82 28.41,16.11 27.89,16.11 27.38,15.6 v27.35,15.6
  Bottom 0.152: U3.35 27.48,15.47 v27.35,15.6
D12  (via drill 0.3)
  Top 0.152: v23.04,14.4 24.39,15.75 24.39,19.31 JP4.5
  Bottom 0.152: v23.04,14.4 22.23,13.6 22.23,7.03 22.66,6.6 24.08,6.6 24.28,6.4 U3.18
D13  (via drill 0.3)
  Top 0.152: JP4.4 24.13,19.68 23.19,18.75 | v22.33,15.18 23.19,16.04 23.19,18.75 | v13.21,16.76 16,16.76 18.8,19.56 22.38,19.56 23.19,18.75
  Bottom 0.152: U3.17 25.4,5.9 25.2,6.1 24.16,6.1 23.95,6.3 22.48,6.3 21.93,6.85 21.93,14.77 v22.33,15.18 | R7.1 7.71,16.76 v13.21,16.76
EN
  Bottom 0.152: U1.3 12.16,10.47 R2.1 13.09,11.4 16.94,11.4 17.27,11.73 17.27,12.15 17.25,12.17 17.25,19.79 JP4.2
GND  (via drill 0.3)
  Bottom 0.254: U3.47 33.48,12.9 v32.51,11.94 33.55,10.9 U3.54 | U3.33 26.48,13.69 26.52,13.64 26.52,13.36 v27.94,11.94 | U3.7 30.98,5.83 v32.51,7.37 | U3.22 26.9,8.4 v27.94,7.37 | U3.65 v29.46,10.41
  other vias: 29.46,8.89 30.99,8.89 30.99,10.41 43.43,11.18 37.59,15.32 42.67,14.99 22.78,9.14 21.26,10.41 41.91,8.89 47.55,10.29 46.99,8.81 37.08,7.37 32.51,19.56 24.99,5.59 7.37,7.11 6.6,12.7 5.84,11.18 11.18,11.18 15.24,14.48 18.75,16 18.08,17.96 36.32,5.44
  pour Top: -0.25,22.86 -0.25,0 50.93,0 50.93,22.86
  pour Bottom: 0,0 51.18,0 51.18,22.86 0,22.86
MISO  (via drill 0.3)
  Top 0.152: v35.97,7.39 35.99,7.37 35.99,5.82 35.81,5.65 35.81,2.29 JP2.4
  Bottom 0.152: U3.61 35.96,7.4 v35.97,7.39
MOSI  (via drill 0.3)
  Top 0.152: v35.46,6.04 34.29,4.87 JP2.5
  Bottom 0.152: U3.63 35.09,6.4 35.24,6.25 35.25,6.25 v35.46,6.04
N$1
  Bottom 0.152: R7.2 LED.A
PROG
  Bottom 0.152: U2.5 12.64,13.18 R4.1
RX
  Bottom 0.152: U3.60 37.42,7.9 40.77,4.55 40.77,2.92 39.37,1.52 JP2.3
SCK  (via drill 0.3)
  Top 0.152: v35.48,6.78 33.78,5.08 33.78,3.3 JP2.6
  Bottom 0.152: U3.62 35.36,6.9 v35.48,6.78
SCL  (via drill 0.3)
  Top 0.152: v31.97,14.9 33.7,14.9 35.19,16.39 v35.21,16.39
  Bottom 0.152: U3.44 v31.98,14.89 v31.97,14.9 | v35.21,16.39 36.48,17.66 39.25,17.66 41.91,20.32 JP4.11
SDA  (via drill 0.3)
  Top 0.152: v31.25,14.9 31.76,14.4 33.92,14.4 v35.21,15.68
  Bottom 0.152: U3.43 31.48,14.68 v31.25,14.9 | v35.21,15.68 35.23,15.68 36.83,17.27 39.37,17.27 43.69,21.59 JP4.12
SEG0  (via drill 0.3)
  Top 0.152: v28.95,4.06 28.29,4.72 25.14,4.72 23.98,5.89 23.98,9.61 23.22,10.37 23.22,11.66 21.89,12.99 21.89,14.45 21.32,15.03 U$6.P$3
  Bottom 0.152: U3.11 28.98,4.09 v28.95,4.06
SEG1  (via drill 0.3)
  Top 0.152: U$6.P$2 20.12,15.8 21.59,14.32 21.59,12.86 22.91,11.54 22.91,10.24 23.67,9.48 23.67,5.76 25.23,4.2 v28.06,4.2
  Bottom 0.152: U3.12 28.48,4.61 v28.06,4.2
SEG2  (via drill 0.3)
  Top 0.152: U$6.P$4 22.52,16.12 21.81,15.41 21.81,14.97 22.22,14.56 22.22,13.1 23.52,11.79 23.52,10.49 24.49,9.53 v24.49,6.92
  Bottom 0.152: U3.19 24.5,6.9 v24.49,6.92
SEG3  (via drill 0.3)
  Top 0.152: v24.99,7.42 24.99,9.46 23.83,10.62 23.83,11.98 23.61,12.2 23.55,12.2 22.52,13.22 22.52,14.63 23.72,15.82 U$6.P$5
  Bottom 0.152: v24.99,7.42 25.02,7.4 U3.20
SEG4  (via drill 0.3)
  Top 0.152: U$6.P$6 24.71,17.55 24.71,15.32 23.25,13.85 v23.25,13.21
  Bottom 0.152: v23.25,13.21 23.25,12.48 23.86,11.87 23.86,10.37 24.83,9.4 U3.24
SEG5  (via drill 0.3)
  Top 0.152: v24.39,10.83 24.44,10.83 26.44,12.83 33.94,12.83 38.12,17.01 U$6.P$17
  Bottom 0.152: U3.25 24.76,9.9 24.39,10.27 v24.39,10.83
SEG6  (via drill 0.3)
  Top 0.152: v24.98,10.42 27.06,12.5 34.04,12.5 37.4,15.86 38.01,15.86 39.32,17.17 U$6.P$18
  Bottom 0.152: v24.98,10.42 25,10.4 U3.26
SEG7  (via drill 0.3)
  Top 0.152: v23.76,12.71 23.79,12.74 23.79,13.66 26.16,16.03 26.16,17.71 U$6.P$7
  Bottom 0.152: v23.76,12.71 23.76,12.61 24.16,12.2 24.16,11.78 24.98,10.95 25.09,10.95 25.15,10.9 U3.27
SEG8  (via drill 0.3)
  Top 0.152: v24.47,12.63 24.47,12.73 24.12,13.08 24.12,13.53 27.32,16.73 U$6.P$8
  Bottom 0.152: v24.47,12.63 24.47,11.9 24.97,11.4 U3.28
SEG9  (via drill 0.3)
  Top 0.152: U$6.P$16 36.92,16.24 33.81,13.13 26.01,13.13 v25,12.12
  Bottom 0.152: v25,12.12 25.21,11.9 U3.29
SEG10  (via drill 0.3)
  Top 0.152: U$6.P$15 35.74,17.73 35.74,15.5 33.69,13.44 24.8,13.44 v24.67,13.32
  Bottom 0.152: U3.30 25.43,12.4 24.67,13.16 v24.67,13.32
SEG11  (via drill 0.3)
  Top 0.152: U$6.P$10 29.72,16.94 28.59,15.81 28.3,15.81 27.76,15.27 27.76,14.98 26.73,13.95 25.41,13.95 v25.38,13.98
  Bottom 0.152: v25.38,13.98 25.18,13.77 25.18,13.17 25.45,12.9 U3.31
SEG12  (via drill 0.3)
  Top 0.152: v25.91,14.46 25.91,14.89 27.44,16.42 28.28,16.42 28.52,16.66 U$6.P$9
  Bottom 0.152: U3.32 25.93,13.5 25.93,14.44 v25.91,14.46
SEG13  (via drill 0.3)
  Top 0.152: v28.97,14.89 28.97,15.32 29.9,16.26 30.2,16.26 30.92,16.97 U$6.P$11
  Bottom 0.152: U3.38 v28.97,14.89
SEG14  (via drill 0.3)
  Top 0.152: U$6.P$12 32.12,17.04 31.69,16.61 31,16.61 29.63,15.24 v29.61,15.24
  Bottom 0.152: U3.39 29.48,14.68 29.48,15.12 v29.61,15.24
SEG15  (via drill 0.3)
  Top 0.152: v30.22,14.88 30.22,15.39 31.14,16.31 32.56,16.31 33.32,17.06 U$6.P$13
  Bottom 0.152: U3.40 29.98,14.64 v30.22,14.88
SEG16  (via drill 0.3)
  Top 0.152: v31.61,15.52 33.25,15.52 34.52,16.79 U$6.P$14
  Bottom 0.152: U3.42 30.98,14.43 30.75,14.66 30.75,15.12 31.15,15.52 v31.61,15.52
STAT
  Bottom 0.152: U2.1 13.97,16.09 10.93,16.09 R3.2
SWCLK  (via drill 0.3)
  Top 0.152: J3.4 43.94,10.41 v43.43,9.91
  Bottom 0.152: TP6.P$1 47.5,13.97 | U3.57 38,9.4 39.04,10.44 42.9,10.44 v43.43,9.91 47.5,13.97 | 47.5,13.97 45.81,13.97 R6.1
SWDIO  (via drill 0.3)
  Top 0.152: v43.43,8.89 43.69,9.14 J3.2 45.32,9.04 v46.99,7.37
  Bottom 0.152: v43.43,8.89 42.2,10.12 39.17,10.12 37.95,8.9 U3.58 | TP7.P$1 47.75,7.37 v46.99,7.37
TX
  Bottom 0.152: U3.59 37.37,8.4 41.91,3.86 JP2.2
USB_N  (via drill 0.3)
  Top 0.152: J2.2 15.61,12.08 17.22,13.69 17.22,14.19 16.87,14.55 16.87,15.2 17.16,15.49 17.78,15.49 v18.29,14.99
  Bottom 0.152: U3.45 32.48,15.39 30.98,16.89 22.59,16.89 20.89,15.19 18.49,15.19 v18.29,14.99
USB_P  (via drill 0.3)
  Top 0.152: J2.3 5.25,11.43 5.6,11.78 15.75,11.78 17.78,13.81 v17.78,14.45
  Bottom 0.152: U3.46 32.98,15.34 31.12,17.2 20.93,17.2 19.23,15.49 18.08,15.49 17.78,15.2 v17.78,14.45
VBACKUP  (via drill 0.3)
  Top 0.254: JP2.1 41.63,4.09 v37.87,4.09
  Bottom 0.254: U3.64 34.79,5.9 36.6,4.09 v37.87,4.09
VBAT  (via drill 0.3)
  Top 0.305: v16.76,11.94 16,11.18 12.95,11.18 v6.6,4.83 | v15.26,17.27 15.18,17.35 12.97,17.35 11.79,16.18 J1.2
  Bottom 0.305: JP4.1 16.51,18.86 C4.1 16.19,18.03 | 16.19,18.03 U2.3 16.77,15.2 v16.77,11.94 v16.76,11.94 | v6.6,4.83 Q1.3 | v15.26,17.27 16.02,18.03 16.19,18.03
VBUS  (via drill 0.3)
  Top 0.305: J2.1 4.23,12.7 v5.59,12.7 | v17.75,16.64 16.19,15.07 v16.19,14.48
  Bottom 0.305: R1.2 7.47,10.82 v5.59,12.7 | R1.2 6.41,9.35 D1.A 6.41,6.97 | R1.2 9.33,12.27 15.79,12.27 16.19,12.67 U2.4 v16.19,14.48 | Q1.1 6.41,6.97 | JP4.3 21.59,20.47 v17.75,16.64 | CHG.A 5.27,5.84 6.41,6.97
VDDCORE
  Bottom 0.254: U3.53 35.61,11.4 37.06,12.85 L1.1 36.32,13.69 C10.1
VDDOUT
  Bottom 0.254: L1.2 35.79,10.92 35.27,10.4 U3.55
VHI
  Bottom 0.254: R2.2 13.88,10.49 13.88,8.04 12.77,6.92 U1.1
  Bottom 0.305: Q1.2 C1.1 9.65,3.91 12.16,6.42 U1.1 11.11,6.92 10.11,7.93 D1.C
VLCD
  Bottom 0.254: U3.23 24.82,8.9 23.64,10.08 C11.2
XIN32
  Bottom 0.152: U3.1 35.65,3.58 38.59,3.58 39.09,4.08 X1.4 39.42,4.29 C13.1
XOUT32
  Bottom 0.152: U3.2 33.48,4.84 33.71,4.61 34.17,4.61 35.6,3.18 X1.1 39.82,3.18 40.25,3.61 40.25,4.58 39.18,5.66 38.54,5.66 C14.1

### Text on the board
tPlace: 8 | 7 | VBAT | EN | VBUS | 13 | 12 | 11 | 10 | 9 | 6 | 5 | SCL | SDA | reset | LCD-oriented SAM L22 Feather / OSO-MISC-21-005 | MI | RST | 3V | ARF | GND | A0 | A1 | A2 | A3 | A4 | A5 | SCK | MO | RX | TX | VBAK | 5 | 6 | 9 | 10 | 11
bPlace: VBAT | EN | VBUS | PA31/LED / 13/SWDIO | PA30 / 12/SWCLK | PA08 / 11 | PA09 / 10 | PA16 / 9 | PA22 / 6 | PA23 / 5 | PA15 / SCL | PA14 / SDA | 8 | 7 | LCD-oriented / SAM L22 Feather / OSO-MISC-21-005 | !RESET | SWCLK | 3V3 | SWDIO | GND | RST / PA28 | 3V3 | AREF / PA03 | GND | A0 / PA02 | A1 / PA04 | A2 / PA05 | A3 / PA06 | A4 / PA07 | 5 | SCK / PA23 | 6 | MOSI / PA22 | 9 | MISO / PA16 | 10 | RX / PA09 | 11 | TX / PA08
tNames: SW1